# EAGLE schematic ardu (EAGLE 7.2.0)
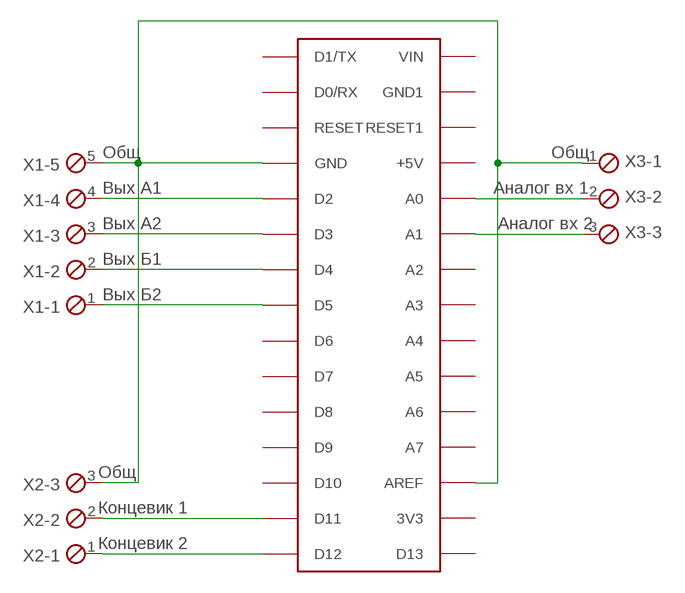
[diagram p0: schematic, sheet 1]

## Parts
U$1  ARDUINONANO  [PDIP-32]
X1  MPT5  [5POL254]
X2  MPT3  [3POL254]
X3  MPT3  [3POL254]

## Nets
N$1: U$1.AREF U$1.GND X1.5 X2.3 X3.1
N$2: U$1.D2 X1.4
N$3: U$1.D3 X1.3
N$4: U$1.D4 X1.2
N$5: U$1.D5 X1.1
N$6: U$1.D11 X2.2
N$7: U$1.D12 X2.1
N$9: U$1.A0 X3.2
N$10: U$1.A1 X3.3
Unconnected: U$1.3V3 U$1.+5V U$1.A2 U$1.A3 U$1.A4 U$1.A5 U$1.A6 U$1.A7 U$1.D0/RX U$1.D1/TX U$1.D6 U$1.D7 U$1.D8 U$1.D9 U$1.D10 U$1.D13 U$1.GND1 U$1.RESET U$1.RESET1 U$1.VIN

## Notes on the sheet
- Общ | Общ
- Вых А1 | Аналог вх 1
- Вых А2 | Аналог вх 2
- Вых Б1
- Вых Б2
- Общ
- Концевик 1
- Концевик 2

## Library data of the parts
U$1 = rocketfarm:ARDUINONANO
X1 = con-phoenix-254:MPT5: PHOENIX CONNECTOR; OC_FARNELL: unknown; OC_NEWARK: unknown
X2 X3 = con-phoenix-254:MPT3: PHOENIX CONNECTOR; OC_FARNELL: unknown; OC_NEWARK: unknown